# EAGLE design SQR_FG_Digital (EAGLE 7.2.0)
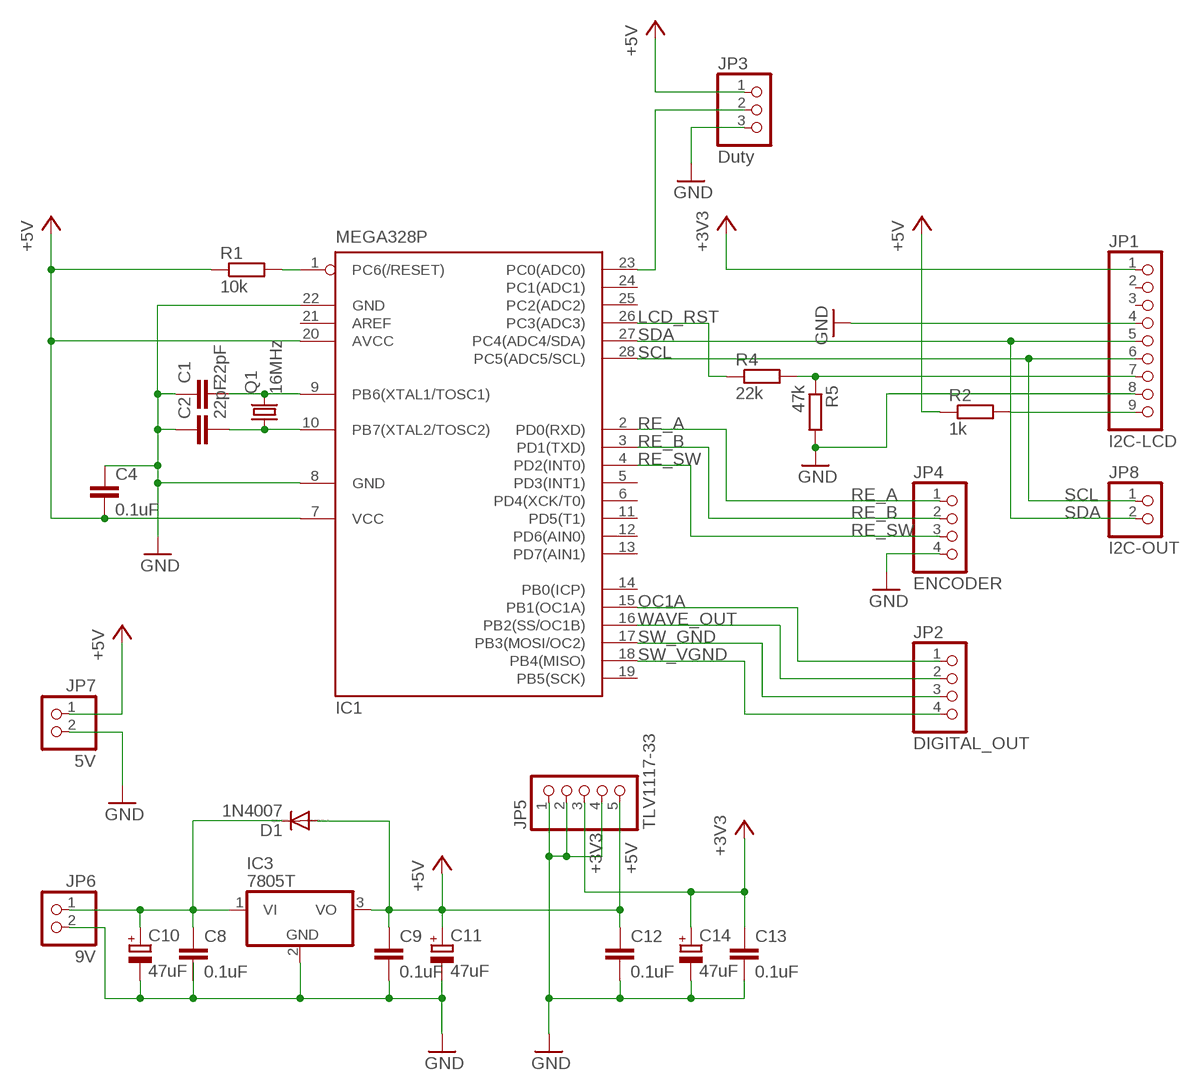
[diagram p0: schematic, sheet 1]

## Parts
C1  22pF  C-EU050-024X044  [C050-024X044]
C2  22pF  C-EU050-024X044  [C050-024X044]
C4  0.1uF  C-EU025-024X044  [C025-024X044]
C8  0.1uF  C-EU025-024X044  [C025-024X044]
C9  0.1uF  C-EU025-024X044  [C025-024X044]
C10  47uF  CPOL-EUTT2D5L  [TT2D5L]
C11  47uF  CPOL-EUTT2D5L  [TT2D5L]
C12  0.1uF  C-EU025-024X044  [C025-024X044]
C13  0.1uF  C-EU025-024X044  [C025-024X044]
C14  47uF  CPOL-EUTT2D5L  [TT2D5L]
D1  1N4007  1N4004  [DO41-10]
IC1  MEGA328P  MEGA8-P  [DIL28-3]
IC3  7805T  [TO220H]
JP1  I2C-LCD  PINHD-1X9  [1X09]
JP2  DIGITAL_OUT  PINHD-1X4  [1X04]
JP3  Duty  PINHD-1X3  [1X03]
JP4  ENCODER  PINHD-1X4  [1X04]
JP5  TLV1117-33  PINHD-1X5  [1X05]
JP6  9V  PINHD-1X2  [1X02]
JP7  5V  PINHD-1X2  [1X02]
JP8  I2C-OUT  PINHD-1X2  [1X02]
Q1  16MHz  CRYSTALHC49S  [HC49/S]
R1  10k  R-EU_0207/10  [0207/10]
R2  1k  R-EU_0207/7  [0207/7]
R4  22k  R-EU_0207/7  [0207/7]
R5  47k  R-EU_0207/7  [0207/7]

## Nets
+3V3: C13.1 C14.+ JP1.1 JP5.3
+5V: C4.2 C9.1 C11.+ C12.1 D1.A IC1.7(VCC) IC1.20(AVCC) IC3.3(VO) JP3.1 JP5.5 JP7.1 R1.1 R2.1
GND: C1.1 C2.1 C4.1 C8.2 C9.2 C10.- C11.- C12.2 C13.2 C14.- IC1.8(GND) IC1.22(GND) IC3.2(GND) JP1.4 JP1.8 JP3.3 JP4.4 JP5.1 JP5.2 JP5.4 JP6.2 JP7.2 R5.2
LCD_RST: IC1.26(PC3(ADC3)) R4.1
N$1: C1.2 IC1.9(PB6(XTAL1/TOSC1)) Q1.2
N$2: C2.2 IC1.10(PB7(XTAL2/TOSC2)) Q1.1
N$3: IC1.1(PC6(/RESET)) R1.2
N$5: C8.1 C10.+ D1.C IC3.1(VI) JP6.1
N$6: JP1.9 R2.2
N$9: IC1.23(PC0(ADC0)) JP3.2
OC1A: IC1.15(PB1(OC1A)) JP2.1
RE_A: IC1.2(PD0(RXD)) JP4.1
RE_B: IC1.3(PD1(TXD)) JP4.2
RE_SW: IC1.4(PD2(INT0)) JP4.3
RST: JP1.7 R4.2 R5.1
SCL: IC1.28(PC5(ADC5/SCL)) JP1.6 JP8.1
SDA: IC1.27(PC4(ADC4/SDA)) JP1.5 JP8.2
SW_GND: IC1.17(PB3(MOSI/OC2)) JP2.3
SW_VGND: IC1.18(PB4(MISO)) JP2.4
WAVE_OUT: IC1.16(PB2(SS/OC1B)) JP2.2
Unconnected: IC1.5(PD3(INT1)) IC1.6(PD4(XCK/T0)) IC1.11(PD5(T1)) IC1.12(PD6(AIN0)) IC1.13(PD7(AIN1)) IC1.14(PB0(ICP)) IC1.19(PB5(SCK)) IC1.21(AREF) IC1.24(PC1(ADC1)) IC1.25(PC2(ADC2)) JP1.2 JP1.3

## Library data of the parts
C1 C2 C4 C8 C9 C12 C13 = rcl:C-EU: CAPACITOR, European symbol
C10 C11 C14 = rcl:CPOL-EU: POLARIZED CAPACITOR, European symbol
D1 = diode:1N4004: DIODE general purpose rectifier, 1 A
IC1 = atmel:MEGA8-P: MICROCONTROLLER 8 Kbytes FLASH, 1 kbytes SRAM, 512 bytes EEPROM, USART, 4-channel 10 bit ADC, 2-channel 8 bit ADC Pin compatible with Atmega48, ATMega88, ATMega168 Source: avr.lbr; OC_FARNELL: unknown; OC_NEWARK: unknown
IC3 = linear:78*: Positive VOLTAGE REGULATOR Source: http://cache.national.com/ds/LM/LM78L05.pdf http://www.fairchildsemi.com/ds/LM/LM7805.pdf
JP1 = pinhead:PINHD-1X9: PIN HEADER
JP2 JP4 = pinhead:PINHD-1X4: PIN HEADER
JP3 = pinhead:PINHD-1X3: PIN HEADER
JP5 = pinhead:PINHD-1X5: PIN HEADER
JP6-JP8 = pinhead:PINHD-1X2: PIN HEADER
Q1 = crystal:CRYSTAL: CRYSTAL; OC_FARNELL: 1667008; OC_NEWARK: unknown
R1 R2 R4 R5 = rcl:R-EU_: RESISTOR, European symbol

## Board
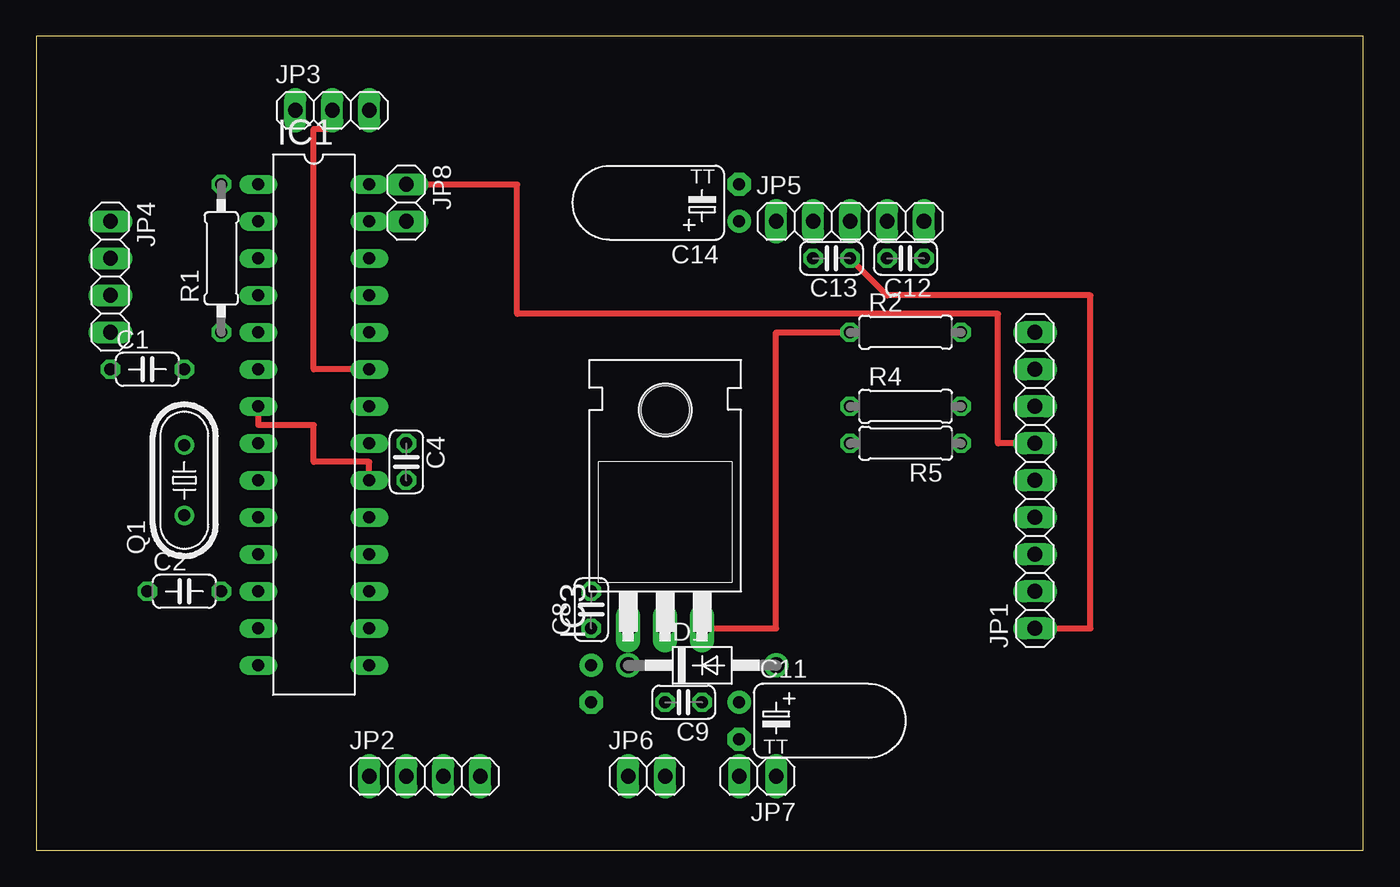
[diagram p1: board, top side]
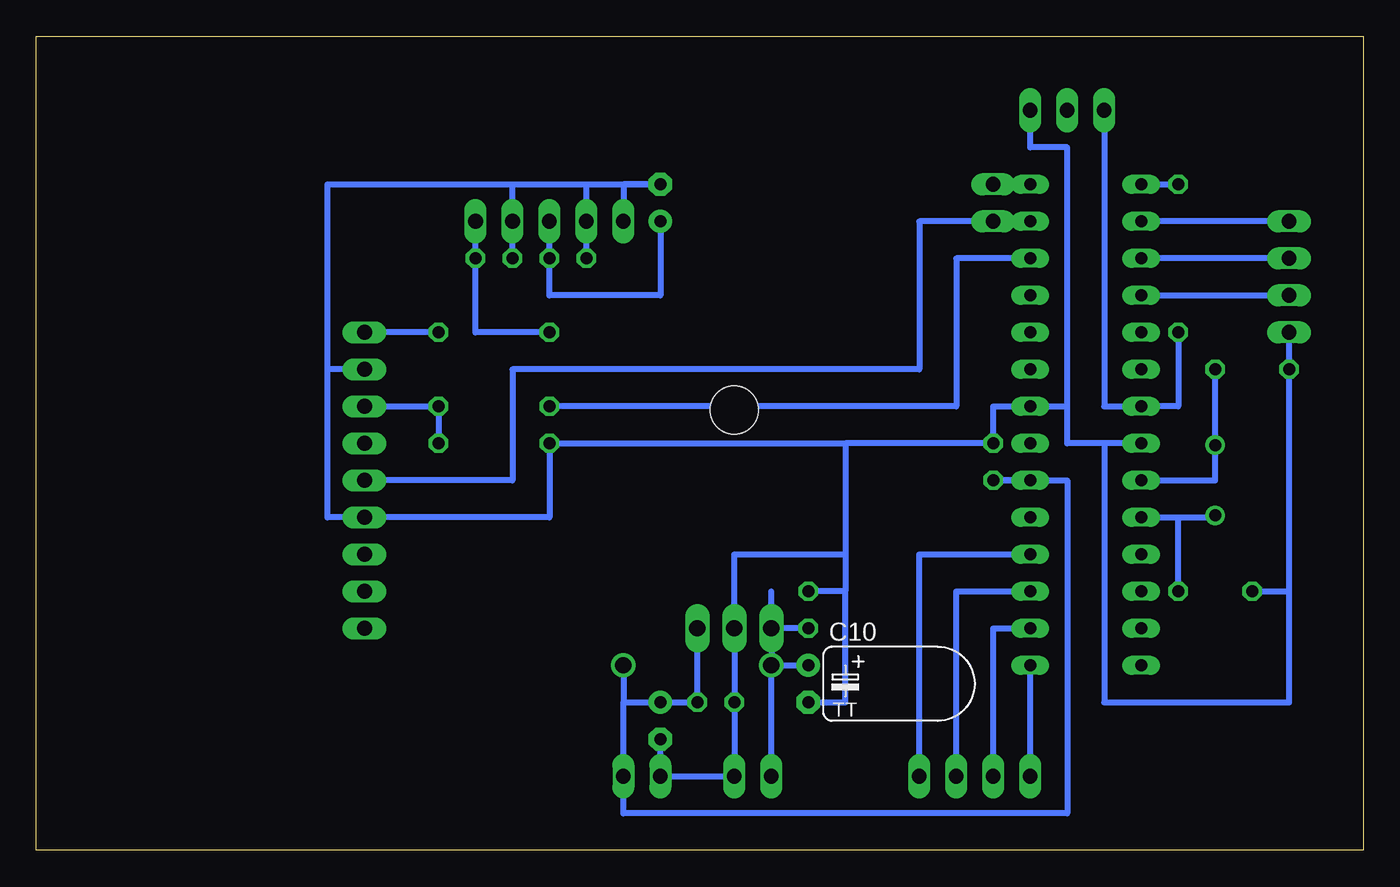
[diagram p2: board, bottom side, seen from below]

Size 91.11 x 55.87 mm. Coordinates in mm from the lower left corner, seen from the top.
Outline: 0,0 91.11,0 91.11,55.87 0,55.87 0,0
Copper layers (1*16): Top 0.035mm / dielectric 1.5mm / Bottom 0.035mm
Design rules "default": minimum track width 10mil, minimum drill 24mil, track to track 8mil, track to pad 8mil, pad to pad 8mil, via to via 8mil, smd to smd 8mil, copper to edge 40mil, drill to drill 8mil, minimum pad ring 10mil, minimum via ring 8mil, stop-mask expansion 4mil, vias tented up to drill 0mil, thermal gap 10mil

### Footprints (pad centres in the part's own frame; a part is rotated, then mirrored left to right if it is on the bottom)
C050-024X044 = drill 0.813 octagon: 1 -2.54,0; 2 2.54,0
C025-024X044 = drill 0.813 octagon: 1 -1.27,0; 2 1.27,0
TT2D5L = drill 0.813 pad 1.6: + -1.27,0 | drill 0.813 pad 1.6 octagon: - 1.27,0
DO41-10 = drill 1.118: A 5.08,0; C -5.08,0
DIL28-3 = drill 0.813 long: 1 -16.51,-3.81; 2 -13.97,-3.81; 3 -11.43,-3.81; 4 -8.89,-3.81; 5 -6.35,-3.81; 6 -3.81,-3.81; 7 -1.27,-3.81; 8 1.27,-3.81; 9 3.81,-3.81; 10 6.35,-3.81; 11 8.89,-3.81; 12 11.43,-3.81; 13 13.97,-3.81; 14 16.51,-3.81; 15 16.51,3.81; 16 13.97,3.81; 17 11.43,3.81; 18 8.89,3.81; 19 6.35,3.81; 20 3.81,3.81; 21 1.27,3.81; 22 -1.27,3.81; 23 -3.81,3.81; 24 -6.35,3.81; 25 -8.89,3.81; 26 -11.43,3.81; 27 -13.97,3.81; 28 -16.51,3.81
TO220H = drill 1.118 long: 1 -2.54,-10.16; 2 0,-10.16; 3 2.54,-10.16 | hole 3.302: 0,4.826
1X09 = drill 1.016 long: 1 -10.16,0; 2 -7.62,0; 3 -5.08,0; 4 -2.54,0; 5 0,0; 6 2.54,0; 7 5.08,0; 8 7.62,0; 9 10.16,0
1X04 = drill 1.016 long: 1 -3.81,0; 2 -1.27,0; 3 1.27,0; 4 3.81,0
1X03 = drill 1.016 long: 1 -2.54,0; 2 0,0; 3 2.54,0
1X05 = drill 1.016 long: 1 -5.08,0; 2 -2.54,0; 3 0,0; 4 2.54,0; 5 5.08,0
1X02 = drill 1.016 long: 1 -1.27,0; 2 1.27,0
HC49/S = drill 0.813: 1 -2.413,0; 2 2.413,0
0207/10 = drill 0.813 octagon: 1 -5.08,0; 2 5.08,0
0207/7 = drill 0.813 octagon: 1 -3.81,0; 2 3.81,0

### Placement (x,y rotation side)
C1  7.62,33.02 0 top
C2  10.16,17.78 0 top
C4  25.4,26.67 270 top
C8  38.1,16.51 90 top
C9  44.45,10.16 180 top
C10  38.1,11.43 270 bottom
C11  48.26,8.89 270 top
C12  59.69,40.64 180 top
C13  54.61,40.64 180 top
C14  48.26,44.45 90 top
D1  45.72,12.7 0 top
IC1  19.05,29.21 270 top
IC3  43.18,25.4 0 top
JP1  68.58,25.4 90 top
JP2  26.67,5.08 0 top
JP3  20.32,50.8 0 top
JP4  5.08,39.37 270 top
JP5  55.88,43.18 0 top
JP6  41.91,5.08 0 top
JP7  49.53,5.08 180 top
JP8  25.4,44.45 270 top
Q1  10.16,25.4 90 top
R1  12.7,40.64 90 top
R2  59.69,35.56 0 top
R4  59.69,30.48 0 top
R5  59.69,27.94 180 top

### Tracks (layer width: path | path; a pad name or v marks a point on that pad's centre or on a via)
+3V3
  Top 0.406: JP1.1 72.39,15.24 72.39,38.1 58.42,38.1 C13.1
  Bottom 0.406: C14.+ 48.26,38.1 55.88,38.1 C13.1 JP5.3
+5V
  Top 0.406: IC3.3 50.8,15.24 50.8,35.56 R2.1 | IC1.7 15.24,29.21 19.05,29.21 19.05,26.67 22.86,26.67 IC1.20
  Bottom 0.406: R1.1 12.7,30.48 IC1.7 17.78,30.48 JP3.1 | IC1.20 C4.2 20.32,25.4 20.32,2.54 50.8,2.54 JP7.1 50.8,10.16 | IC3.3 C9.1 C11.+ 50.8,10.16 | D1.A 50.8,10.16 | JP5.5 C12.1 60.96,35.56 R2.1
GND
  Bottom 0.406: 5.08,17.78 5.08,10.16 17.78,10.16 17.78,27.94 | 5.08,17.78 C1.1 JP4.4 | IC1.8 17.78,27.94 | 20.32,30.48 IC1.22 25.4,30.48 C4.1 35.56,27.94 | 20.32,30.48 20.32,48.26 22.86,48.26 JP3.3 | C11.- JP7.2 JP6.2 C9.2 IC3.2 43.18,20.32 35.56,20.32 | C10.- 35.56,10.16 35.56,17.78 | 35.56,17.78 C8.2 | 35.56,27.94 35.56,20.32 | 35.56,20.32 35.56,17.78 | 35.56,27.94 R5.2 55.88,22.86 JP1.4 71.12,22.86 71.12,33.02 | JP1.8 71.12,33.02 | 71.12,33.02 71.12,45.72 58.42,45.72 | 58.42,45.72 53.34,45.72 | 53.34,45.72 C14.- 50.8,45.72 JP5.1 | C2.1 5.08,17.78 | 53.34,45.72 JP5.2 C13.2 | 58.42,45.72 JP5.4 C12.2 | 17.78,27.94 20.32,27.94 20.32,30.48
LCD_RST
  Bottom 0.406: IC1.26 27.94,40.64 27.94,30.48 R4.1
N$1
  Bottom 0.406: IC1.9 10.16,25.4 Q1.2 C1.2
N$2
  Bottom 0.406: IC1.10 12.7,22.86 | 12.7,22.86 10.16,22.86 Q1.1 | C2.2 12.7,22.86
N$3
  Bottom 0.406: IC1.1 R1.2
N$5
  Bottom 0.406: IC3.1 40.64,17.78 | IC3.1 D1.C | D1.C C10.+ | JP6.1 D1.C | C8.1 IC3.1
N$6
  Bottom 0.406: R2.2 JP1.9
N$9
  Top 0.406: IC1.23 19.05,33.02 19.05,49.53 20.32,49.53 JP3.2
OC1A
  Bottom 0.406: JP2.1 IC1.15
RE_A
  Bottom 0.406: JP4.1 IC1.2
RE_B
  Bottom 0.406: JP4.2 IC1.3
RE_SW
  Bottom 0.406: IC1.4 JP4.3
RST
  Bottom 0.406: R5.1 R4.2 JP1.7
SCL
  Top 0.406: JP1.6 66.04,27.94 66.04,36.83 33.02,36.83 33.02,45.72 JP8.1
  Bottom 0.406: IC1.28 JP8.1
SDA
  Bottom 0.406: JP1.5 58.42,25.4 58.42,33.02 30.48,33.02 30.48,43.18 JP8.2 IC1.27
SW_GND
  Bottom 0.406: JP2.3 27.94,17.78 IC1.17
SW_VGND
  Bottom 0.406: JP2.4 30.48,20.32 IC1.18
WAVE_OUT
  Bottom 0.406: JP2.2 25.4,15.24 IC1.16